# Altium schematic sheet percepcao_externa_alimentacao.SchDoc
size A4; SheetNumber: 2; SheetTotal: 4
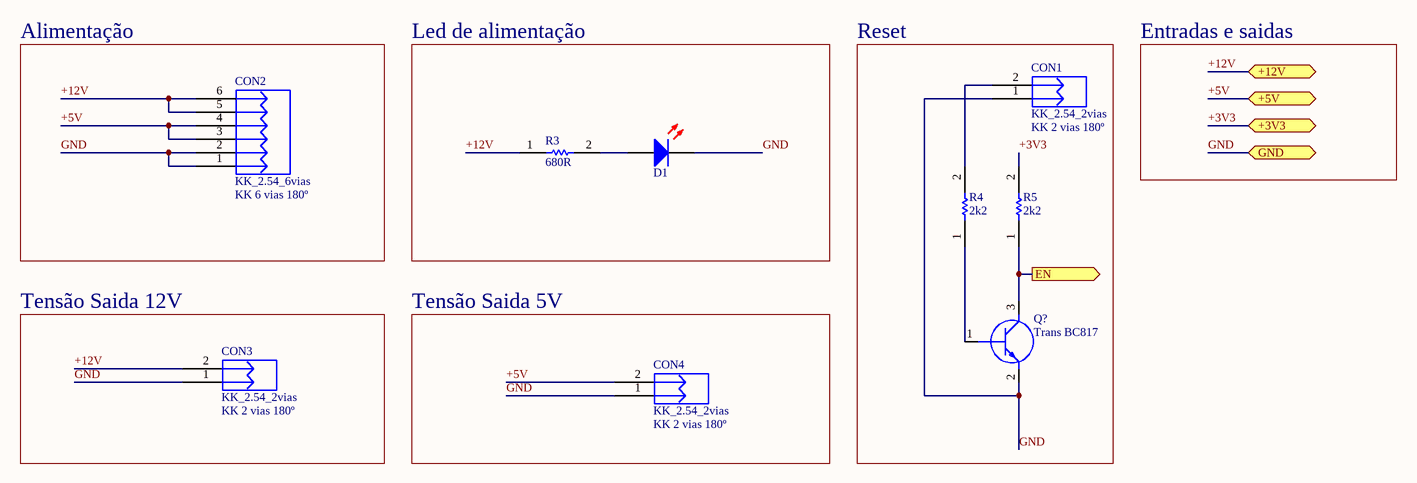
[diagram p0: percepcao_externa_alimentacao.SchDoc]

## Parts
CON1  KK_2.54_2vias  Valor: KK 2 vias 180º  [KK_2VIAS_180º]
CON2  KK_2.54_6vias  Valor: KK 6 vias 180º  [KK_6vias_180°]
CON3  KK_2.54_2vias  Valor: KK 2 vias 180º  [KK_2VIAS_180º]
CON4  KK_2.54_2vias  Valor: KK 2 vias 180º  [KK_2VIAS_180º]
D1  LED 5MM RED  [LED 5MM RED]  (value not drawn)
Q?  Trans BC817  [SOT96P240X110-3N]
R3  680R  [RESC3216X60N]
R4  2k2  [RESC3216X60N]
R5  2k2  [RESC3216X60N]

## Blocks framed on the sheet
Alimentação: CON2
Led de alimentação: D1 R3
Reset: CON1 Q? R4 R5
Tensão Saida 12V: CON3
Tensão Saida 5V: CON4

## Ports
+3V3 (bidir), +5V (bidir), +12V (bidir), EN (out), GND (bidir)

## Nets
+3V3: R5.2 ; port +3V3
+5V: CON2.3 CON2.4 CON4.2 ; port +5V
+12V: CON2.5 CON2.6 CON3.2 R3.1 ; port +12V
EN: Q?.3(C) R5.1 ; port EN
GND: CON1.1 CON2.1 CON2.2 CON3.1 CON4.1 D1.2(K) Q?.2(E) ; port GND
NetCON1_2: CON1.2 R4.2
NetD1_1: D1.1(A) R3.2
NetQ?_1: Q?.1(B) R4.1

## Notes on the sheet
- Entradas e saidas

## Library data of the parts
CON1 CON3 CON4 = KK_2.54_2vias: Conector KK 2.54mm 2 vias; Descrição: Conector KK 3 vias com passo 2.54mm; Encapsulamento: PTH - 180º; Modelo: 2 vias - 180º; Marca: *; Observação: *
CON2 = KK_2.54_6vias: Conector KK 2.54mm 6 vias; Descrição: Conector KK 3 vias com passo 2.54mm; Encapsulamento: PTH - 180º; Modelo: 3 vias - 180º; Marca: *; Observação: *
D1 = LED 5MM RED: Manufacturer: Paralight; Manufacturer Part Number: IMP585; Bulb Size: 3mm; Wavelength Typ: 625; Forward Voltage: 2; Forward Current If: 20; Luminous Intensity: 3; LED Mounting: Through Hole; Lens Shape: Round; Viewing Angle: 60°; SVHC: No SVHC (15-Jun-2015); External Diameter: 2.9; External Length / Height: 4.6; Forward Voltage VF Max: 2.5; LED / Lamp Size: 3mm / T-1; LED Type: Standard; Lead Cross-section Depth: 0.5; Luminous Intensity @ If Min: 0.7; PIV Max: 5; Peak Forward Current: 7; Voltage Vf Typ: 2.2V<!--FANDB--><div class="features-and-benefits-container"><div class="features-and-benefits-description"><span class="features-benefits-value">The L-934LID from Kingbright is a through hole round shape high efficiency red colour LED. The device is made of gallium arsenide phosphide on gallium phosphide orange light emitting diode. This LED is widely used because of low power consumption, long life and solid state reliability.</span></div><div class="features-and-benefits-list"><ul class="features-and-benefits-list-list"><li class="features-and-benefits-list-item">Standard bulb size of T-1 (3mm)</li><li class="features-and-benefits-list-item">Reliable and rugged</li><li class="features-and-benefits-list-item">Viewing angle is 60°</li><li class="features-and-benefits-list-item">Luminous intensity of 3mcd at 2mA</li><li class="features-and-benefits-list-item">Forward voltage is 2.0V</li><li class="features-and-benefits-list-item">Forward current (If) is 20mA</li><li class="features-and-benefits-list-item">Dominant wavelength is 625nm at IF=20mA</li><li class="features-and-benefits-list-item">Peak wavelength is 627nm at IF=20; Supplier 1: Mult Comercial; RoHS: YES; Stock 1: 35260; Pricing 1: 1=0.15 (BRL); LED Colour: Red; Packaging: Each; MSL: -; Current If Luminous Intensity: 2; Dominant Wavelength: 625; Forward Current If Max: 20; Lead Cross-section Width: 0.5; Lead Spacing: 2.54; Luminous Intensity Typ: 3; Mounting Type: PCB Through Hole; No. of Pins: 2; Operating Temperature Max: 85; Operating Temperature Min: -40; Operating Temperature Range: -40°C to +85; Peak Wavelength: 625; ComponentLink1URL: http://loja.multcomercial.com.br/led-3mm-vermelho-difuso-l-314hd-paralight.html; ComponentLink1Description: http://loja.multcomercial.com.br/led-3mm-vermelho-difuso-l-314hd-paralight.html; Supplier Part Number 1: Led 3mm Vermelho Difuso L-314HD - Paralight
Q? = Trans BC817: Transistor BJT NPN BC817-25-7-F; Manufacturer_Name: Diodes Inc.; Datasheet Link: https://www.diodes.com/assets/Datasheets/ds11107.pdf; Height: 1.1mm; Manufacturer_Part_Number: BC817-25-7-F; Mouser Part Number: 621-BC817-25-7-F; Mouser Price/Stock: https://www.mouser.co.uk/ProductDetail/Diodes-Incorporated/BC817-25-7-F?qs=rGAXPo9uwV0jK0EyLZnqOw%3D%3D; Arrow Part Number: BC817-25-7-F; Arrow Price/Stock: https://www.arrow.com/en/products/bc817-25-7-f/diodes-incorporated
R3-R5 = Resistor 1206: Resistor; Manufacturer_Name: Vishay; Manufacturer_Part_Number: CRCW12064K70FKEA; Datasheet Link: http://docs-emea.rs-online.com/webdocs/13ec/0900766b813ecc08.pdf; Height: 0.6mm; Mouser Part Number: 71-CRCW1206-4.7K-E3; Mouser Price/Stock: https://www.mouser.co.uk/ProductDetail/Vishay-Dale/CRCW12064K70FKEA?qs=1vm4qhDHCvlKJmatsKzyFQ%3D%3D; Arrow Part Number: CRCW12064K70FKEA; Arrow Price/Stock: https://www.arrow.com/en/products/crcw12064k70fkea/vishay